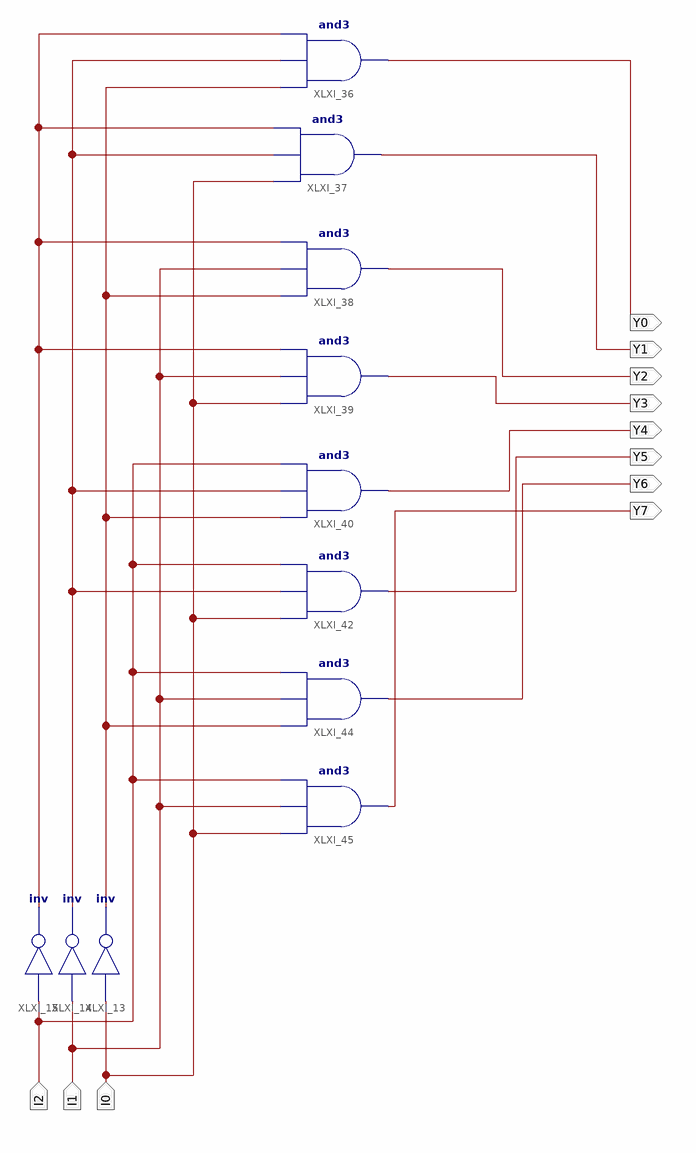
[diagram p0: schematic sheet 1]
// Xilinx ISE schematic DECODER_3TO8.sch (spartan3e) as structural Verilog: 11 symbols, 11 ports
module DECODER_3TO8 (
  input  I0,
  input  I1,
  input  I2,
  output Y0,
  output Y1,
  output Y2,
  output Y3,
  output Y4,
  output Y5,
  output Y6,
  output Y7
);

  wire XLXN_2, XLXN_4, XLXN_8;

  not XLXI_13 (XLXN_2, I0);
  not XLXI_14 (XLXN_8, I1);
  not XLXI_15 (XLXN_4, I2);
  and XLXI_36 (Y0, XLXN_2, XLXN_8, XLXN_4);
  and XLXI_37 (Y1, I0, XLXN_8, XLXN_4);
  and XLXI_38 (Y2, XLXN_2, I1, XLXN_4);
  and XLXI_39 (Y3, I0, I1, XLXN_4);
  and XLXI_40 (Y4, XLXN_2, XLXN_8, I2);
  and XLXI_42 (Y5, I0, XLXN_8, I2);
  and XLXI_44 (Y6, XLXN_2, I1, I2);
  and XLXI_45 (Y7, I0, I1, I2);
endmodule
